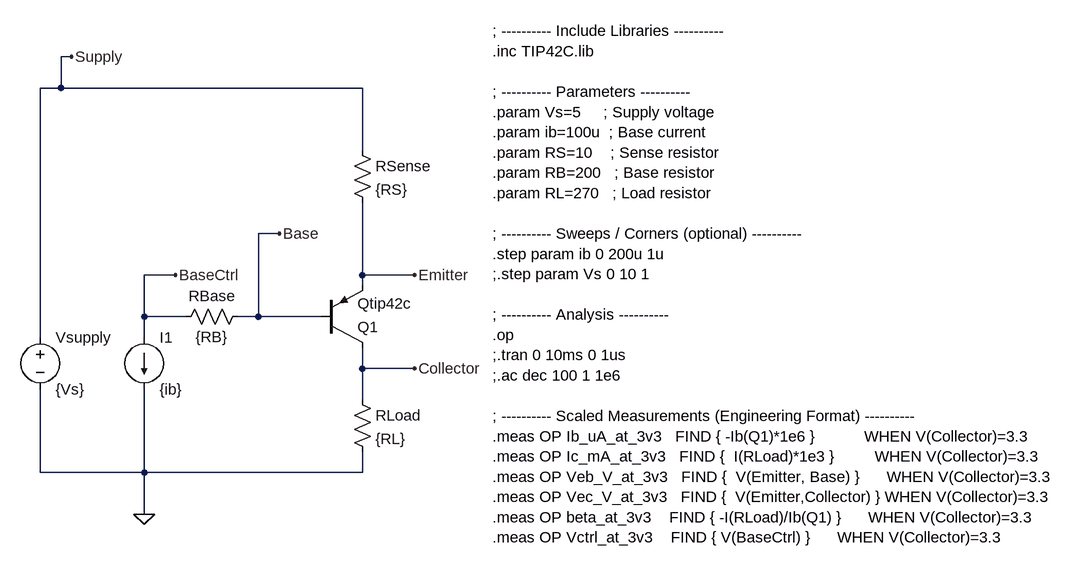
[diagram p0: schematic TIP42_Characterization.asc]
TIP42_Characterization.asc, the LTspice schematic file:
Version 4.1
SHEET 1 1388 764
WIRE -224 -384 -240 -384
WIRE -240 -336 -240 -384
WIRE -240 -336 -272 -336
WIRE 224 -336 -240 -336
WIRE 224 -240 224 -336
WIRE 96 -112 64 -112
WIRE -64 -48 -112 -48
WIRE 224 -48 224 -160
WIRE 304 -48 224 -48
WIRE 224 -32 224 -48
WIRE -112 16 -112 -48
WIRE -48 16 -112 16
WIRE 64 16 64 -112
WIRE 64 16 32 16
WIRE 160 16 64 16
WIRE -272 48 -272 -336
WIRE -112 48 -112 16
WIRE 224 96 224 64
WIRE 304 96 224 96
WIRE 224 144 224 96
WIRE -272 256 -272 128
WIRE -112 256 -112 128
WIRE -112 256 -272 256
WIRE 224 256 224 224
WIRE 224 256 -112 256
WIRE -112 320 -112 256
FLAG -112 320 0
FLAG 96 -112 Base
FLAG 304 96 Collector
FLAG 304 -48 Emitter
FLAG -224 -384 Supply
FLAG -64 -48 BaseCtrl
SYMBOL pnp 160 64 M180
SYMATTR InstName Q1
SYMATTR Value Qtip42c
SYMBOL voltage -272 32 R0
SYMATTR InstName Vsupply
SYMATTR Value {Vs}
SYMBOL res 208 128 R0
SYMATTR InstName RLoad
SYMATTR Value {RL}
SYMBOL res 208 -256 R0
SYMATTR InstName RSense
SYMATTR Value {RS}
SYMBOL current -112 48 R0
SYMATTR InstName I1
SYMATTR Value {ib}
SYMBOL res 48 0 R90
WINDOW 0 0 56 VBottom 2
WINDOW 3 32 56 VTop 2
SYMATTR InstName RBase
SYMATTR Value {RB}
TEXT 424 -424 Left 2 !; ---------- Include Libraries ----------\n.inc TIP42C.lib\n \n; ---------- Parameters ----------\n.param Vs=5     ; Supply voltage\n.param ib=100u  ; Base current \n.param RS=10    ; Sense resistor\n.param RB=200   ; Base resistor\n.param RL=270   ; Load resistor\n \n; ---------- Sweeps / Corners (optional) ----------\n.step param ib 0 200u 1u\n;.step param Vs 0 10 1\n \n; ---------- Analysis ----------\n.op\n;.tran 0 10ms 0 1us\n;.ac dec 100 1 1e6\n \n; ---------- Scaled Measurements (Engineering Format) ----------\n.meas OP Ib_uA_at_3v3   FIND { -Ib(Q1)*1e6 }           WHEN V(Collector)=3.3\n.meas OP Ic_mA_at_3v3   FIND {  I(RLoad)*1e3 }         WHEN V(Collector)=3.3\n.meas OP Veb_V_at_3v3   FIND {  V(Emitter, Base) }      WHEN V(Collector)=3.3\n.meas OP Vec_V_at_3v3   FIND {  V(Emitter,Collector) } WHEN V(Collector)=3.3\n.meas OP beta_at_3v3    FIND { -I(RLoad)/Ib(Q1) }      WHEN V(Collector)=3.3\n.meas OP Vctrl_at_3v3    FIND { V(BaseCtrl) }      WHEN V(Collector)=3.3

The netlist it stands for:
* TIP42_Characterization.asc
Q1 Collector Base Emitter 0 Qtip42c
Vsupply Supply 0 {Vs}
RLoad Collector 0 {RL}
RSense Supply Emitter {RS}
I1 BaseCtrl 0 {ib}
RBase Base BaseCtrl {RB}
.model NPN NPN
.model PNP PNP
.lib standard.bjt
; ---------- Include Libraries ----------
.inc TIP42C.lib
; ---------- Parameters ----------
.param Vs=5     ; Supply voltage
.param ib=100u  ; Base current
.param RS=10    ; Sense resistor
.param RB=200   ; Base resistor
.param RL=270   ; Load resistor
; ---------- Sweeps / Corners (optional) ----------
.step param ib 0 200u 1u
;.step param Vs 0 10 1
; ---------- Analysis ----------
.op
;.tran 0 10ms 0 1us
;.ac dec 100 1 1e6
; ---------- Scaled Measurements (Engineering Format) ----------
.meas OP Ib_uA_at_3v3   FIND { -Ib(Q1)*1e6 }           WHEN V(Collector)=3.3
.meas OP Ic_mA_at_3v3   FIND {  I(RLoad)*1e3 }         WHEN V(Collector)=3.3
.meas OP Veb_V_at_3v3   FIND {  V(Emitter, Base) }      WHEN V(Collector)=3.3
.meas OP Vec_V_at_3v3   FIND {  V(Emitter,Collector) } WHEN V(Collector)=3.3
.meas OP beta_at_3v3    FIND { -I(RLoad)/Ib(Q1) }      WHEN V(Collector)=3.3
.meas OP Vctrl_at_3v3    FIND { V(BaseCtrl) }      WHEN V(Collector)=3.3
.backanno
.end